# EAGLE design l293d_module (EAGLE 7.4.0)
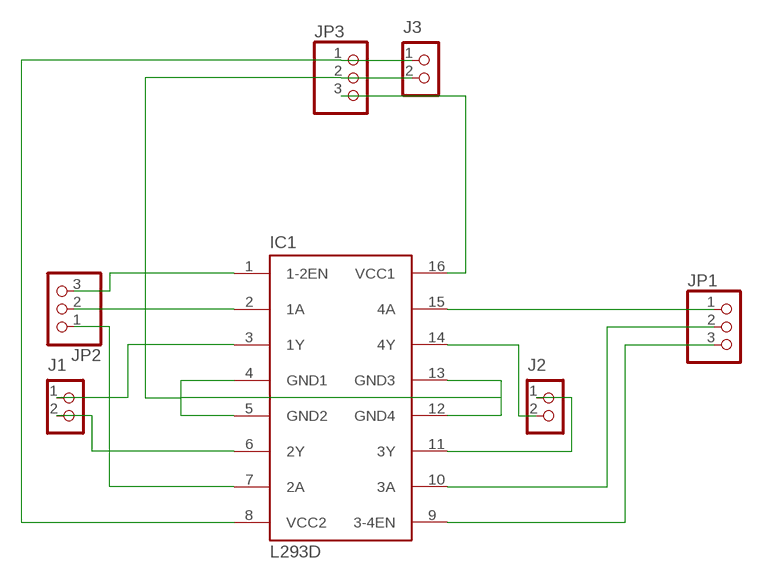
[diagram p0: schematic, sheet 1]

## Parts
IC1  L293D  [DIL16]
J1  CON_TERMINAL_BLOCK_02-5MM  [TERMINAL_BLOCK_2P_5]
J2  CON_TERMINAL_BLOCK_02-5MM  [TERMINAL_BLOCK_2P_5]
J3  CON_TERMINAL_BLOCK_02-5MM  [TERMINAL_BLOCK_2P_5]
JP1  PINHD-1X3  [1X03]
JP2  PINHD-1X3  [1X03]
JP3  PINHD-1X3  [1X03]

## Nets
1A: IC1.2(1A) JP2.2
2A: IC1.7(2A) JP2.1
3B: IC1.10(3A) JP1.2
4B: IC1.15(4A) JP1.1
5V: IC1.16(VCC1) JP3.3
ENA: IC1.1(1-2EN) JP2.3
ENB: IC1.9(3-4EN) JP1.3
GND: IC1.4(GND1) IC1.5(GND2) IC1.12(GND4) IC1.13(GND3) J3.2 JP3.2
N$12: IC1.3(1Y) J1.1
N$13: IC1.6(2Y) J1.2
N$14: IC1.14(4Y) J2.2
N$15: IC1.11(3Y) J2.1
VIN: IC1.8(VCC2) J3.1 JP3.1

## Library data of the parts
IC1 = st-microelectronics:L293D: PUSH-PULL 4 CHANNEL DRIVER; MPN: L293D; OC_FARNELL: 9589619; OC_NEWARK: 56P8249
J1-J3 = dp_devices:CON_TERMINAL_BLOCK_02: 2 poles wire to board terminal block
JP1-JP3 = pinhead:PINHD-1X3: PIN HEADER

## Board
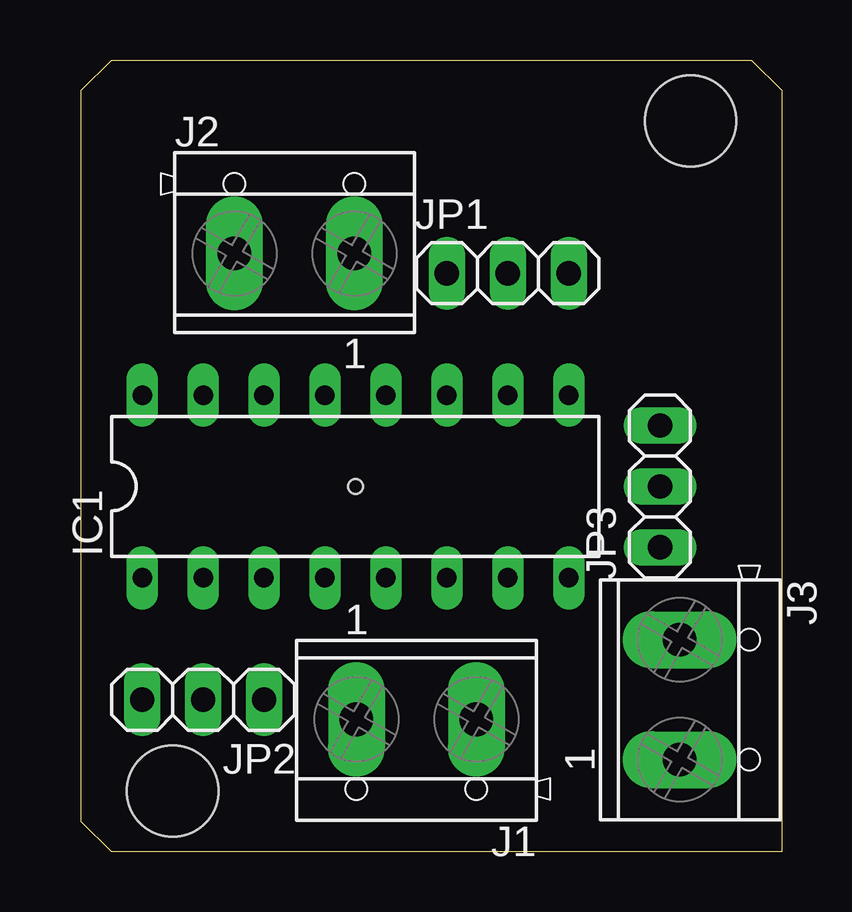
[diagram p1: board, top side]
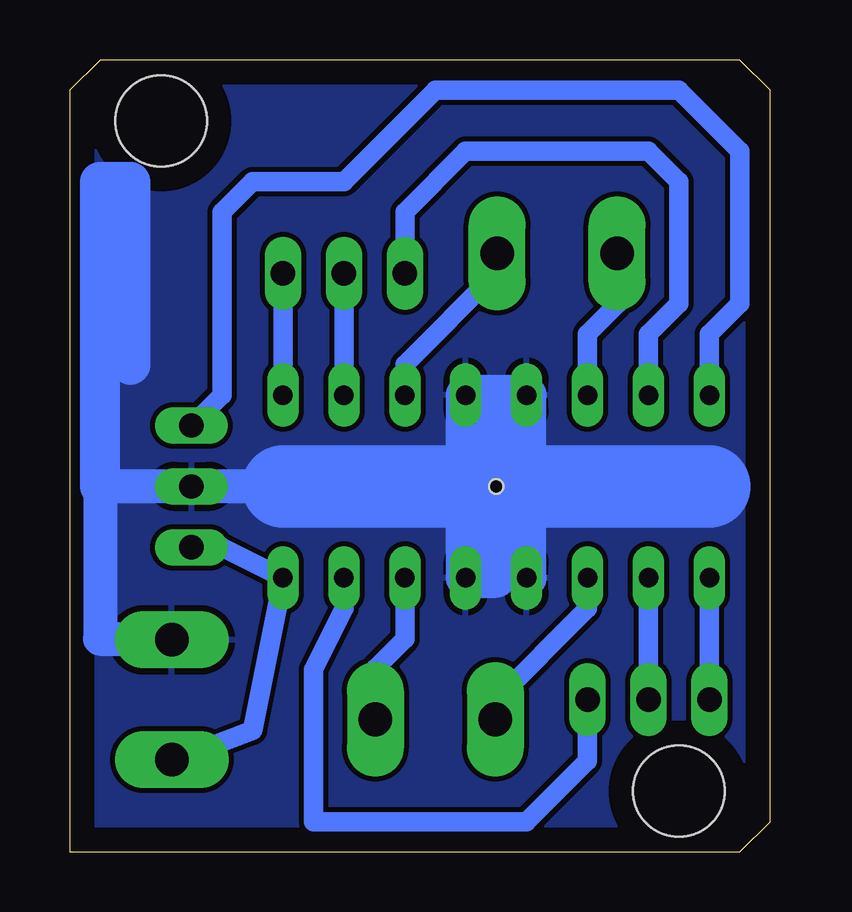
[diagram p2: board, bottom side, seen from below]

Size 29.21 x 33.02 mm. Coordinates in mm from the lower left corner, seen from the top.
Outline: 0,31.75 1.27,33.02 27.94,33.02 29.21,31.75 29.21,0 1.27,0 0,1.27 0,31.75
Copper layers (1*16): Top 0.035mm / dielectric 1.5mm / Bottom 0.035mm
Design rules "default": minimum track width 10mil, minimum drill 24mil, track to track 8mil, track to pad 8mil, pad to pad 8mil, via to via 8mil, smd to smd 8mil, copper to edge 40mil, drill to drill 8mil, minimum pad ring 10mil, minimum via ring 8mil, stop-mask expansion 4mil, vias tented up to drill 0mil, thermal gap 10mil
Holes 3.81 mm at 25.4,30.48 3.81,2.54
Holes 0.6 mm at 11.43,15.24

### Footprints (pad centres in the part's own frame; a part is rotated, then mirrored left to right if it is on the bottom)
DIL16 = drill 0.813 long: 1 -8.89,-3.81; 2 -6.35,-3.81; 3 -3.81,-3.81; 4 -1.27,-3.81; 5 1.27,-3.81; 6 3.81,-3.81; 7 6.35,-3.81; 8 8.89,-3.81; 9 8.89,3.81; 10 6.35,3.81; 11 3.81,3.81; 12 1.27,3.81; 13 -1.27,3.81; 14 -3.81,3.81; 15 -6.35,3.81; 16 -8.89,3.81
TERMINAL_BLOCK_2P_5 = drill 1.4 pad 2.38 long: 1 2.5,-0.45; 2 -2.5,-0.45
1X03 = drill 1.016 long: 1 -2.54,0; 2 0,0; 3 2.54,0

### Placement (x,y rotation side)
IC1  11.43,15.24 0 top
J1  13.97,5.08 180 top
J2  8.89,25.4 0 top
J3  25.4,6.35 270 top
JP1  17.78,24.13 0 top
JP2  5.08,6.35 180 top
JP3  24.13,15.24 90 top

### Tracks (layer width: path | path; a pad name or v marks a point on that pad's centre or on a via)
1A
  Bottom 0.813: JP2.2 IC1.2
2A
  Bottom 0.813: IC1.7 17.78,10.16 19.05,7.62 19.05,1.27 10.16,1.27 7.62,3.81 JP2.1
3B
  Bottom 0.813: JP1.2 IC1.10
4B
  Bottom 0.813: IC1.15 5.08,21.59 3.81,22.86 3.81,27.94 5.08,29.21 12.7,29.21 15.24,26.67 JP1.1
5V
  Bottom 0.813: JP3.3 22.86,19.05 22.86,26.67 21.59,27.94 17.78,27.94 13.97,31.75 3.81,31.75 1.27,29.21 1.27,22.86 2.54,21.59 IC1.16
ENA
  Bottom 0.813: JP2.3 IC1.1
ENB
  Bottom 0.813: IC1.9 JP1.3
GND
  Bottom 1.422: 20.32,15.24 JP3.2 27.94,15.24 27.94,8.89 24.99,8.89 J3.2
  Bottom 1.676: 11.43,19.05 11.43,11.43 IC1.5 12.7,15.24 IC1.12 IC1.13 IC1.4 | 27.94,15.24 27.94,27.94 26.67,27.94 26.67,20.32
  Bottom 3.429: 2.54,15.24 12.7,15.24 20.32,15.24
  pour Bottom: -2.54,35.56 31.75,35.56 31.75,-2.54 -2.54,-2.54
N$12
  Bottom 0.813: J1.1 11.47,6.31 7.62,10.16 IC1.3
N$13
  Bottom 0.813: J1.2 16.47,7.66 15.24,8.89 IC1.6
N$14
  Bottom 0.813: IC1.14 7.62,21.59 6.35,22.86 6.35,24.91 J2.2
N$15
  Bottom 0.813: IC1.11 15.24,20.32 11.43,24.13 11.43,24.91 J2.1
VIN
  Bottom 0.813: JP3.1 22.86,12.7 IC1.8 21.59,5.08 24.91,3.81 J3.1